# EAGLE schematic airswimmer-controller (EAGLE 6.4)
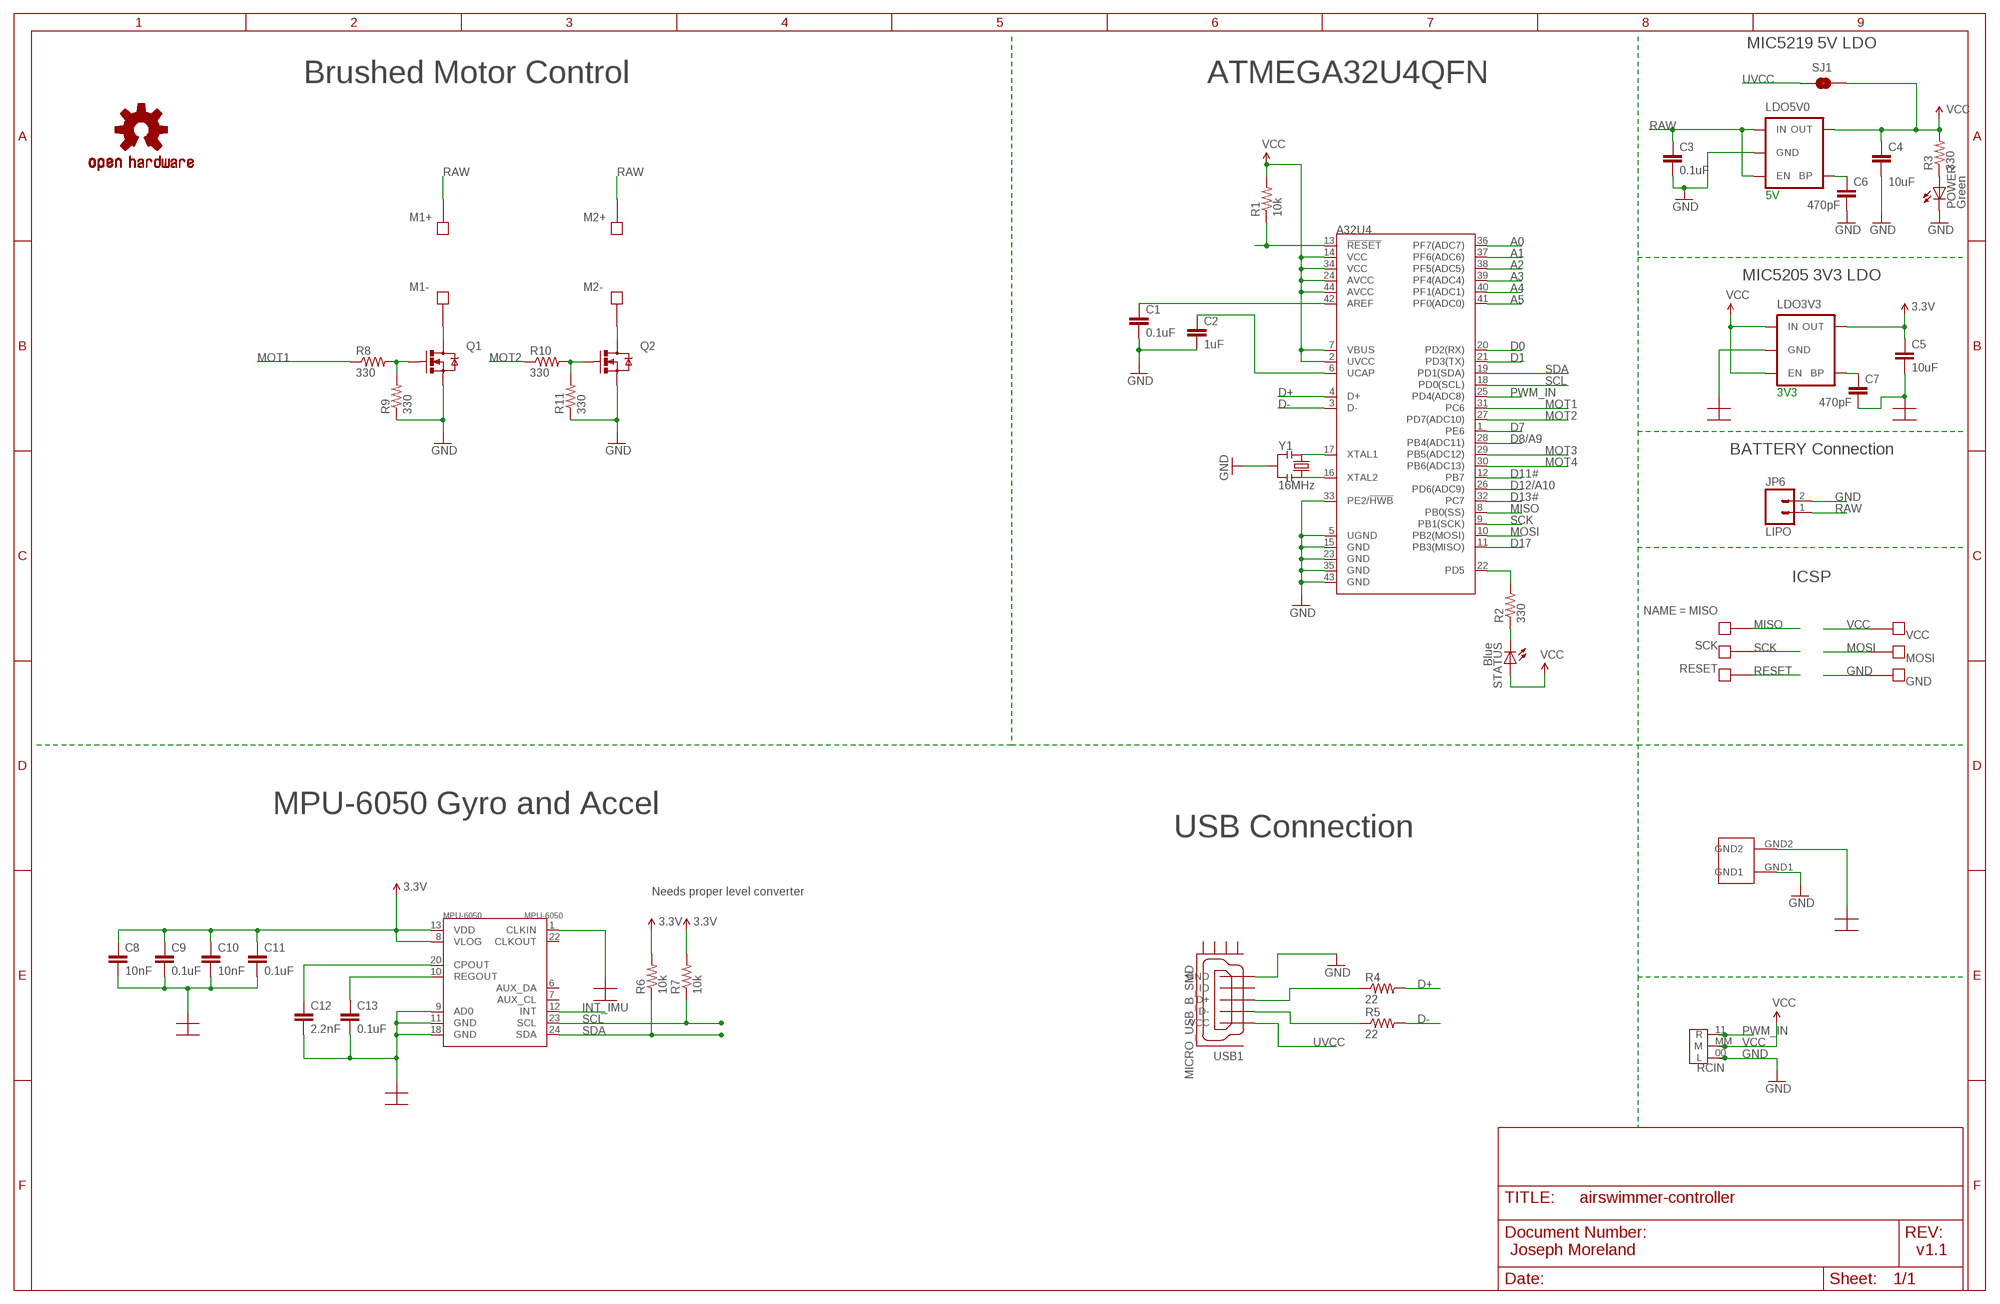
[diagram p0: schematic, sheet 1]

## Parts
A32U4  ATMEGA32U4QFN  [ATMEL_QFN-44_SMALL_PAD]
C1  0.1uF  SPARKFUN_CAP0402-CAP  [SPARKFUN_0402-CAP]
C2  1uF  SPARKFUN_CAP0402-CAP  [SPARKFUN_0402-CAP]
C3  0.1uF  SPARKFUN_CAP0402-CAP  [SPARKFUN_0402-CAP]
C4  10uF  CAP0603-CAP  [0603-CAP]
C5  10uF  CAP0603-CAP  [0603-CAP]
C6  470pF  CAP0603-CAP  [0603-CAP]
C7  470pF  CAP0603-CAP  [0603-CAP]
C8  10nF  CAP0402-CAP  [0402-CAP]
C9  0.1uF  CAP0402-CAP  [0402-CAP]
C10  10nF  CAP0402-CAP  [0402-CAP]
C11  0.1uF  CAP0402-CAP  [0402-CAP]
C12  2.2nF  CAP0402-CAP  [0402-CAP]
C13  0.1uF  CAP0402-CAP  [0402-CAP]
GND  TEST_PAD  [ICSP_PAD]
GND_SHORT  GND_SHORT  [GND_SHORT]
JP6  LIPO  M02LOCK  [1X02_LOCK]
LDO3V3  V_REG_MIC52193.3V  [SOT23-5]
LDO5V0  MIC5219  V_REG_MIC52195V  [SOT23-5]
LOGO1  OSHW-LOGOM  [OSHW-LOGO-M]
M1+  SOLDER_PAD.05X.05  [SOLDER_PAD_.05X.05]
M1-  SOLDER_PAD.05X.05  [SOLDER_PAD_.05X.05]
M2+  SOLDER_PAD.05X.05  [SOLDER_PAD_.05X.05]
M2-  SOLDER_PAD.05X.05  [SOLDER_PAD_.05X.05]
MISO  TEST_PAD  [ICSP_PAD]
MOSI  TEST_PAD  [ICSP_PAD]
MPU-6050  MPU-6050  IMU3000  [QFN-24]
POWER  Green  LED0603  [LED-0603]
Q1  MOSFET-NCHANNELBSS123LT1G  [SOT23]
Q2  MOSFET-NCHANNELBSS123LT1G  [SOT23]
R1  10k  RESISTOR0402-RES  [0402-RES]
R2  330  RESISTOR0402-RES  [0402-RES]
R3  330  RESISTOR0402-RES  [0402-RES]
R4  22  RESISTOR0402-RES  [0402-RES]
R5  22  RESISTOR0402-RES  [0402-RES]
R6  10k  RESISTOR0402-RES  [0402-RES]
R7  10k  RESISTOR0402-RES  [0402-RES]
R8  330  RESISTOR0402-RES  [0402-RES]
R9  330  RESISTOR0402-RES  [0402-RES]
R10  330  RESISTOR0402-RES  [0402-RES]
R11  330  RESISTOR0402-RES  [0402-RES]
RCIN  PAD-JUMPER-3P40*40  [3P-SMD-4.1X1.5]
RESET  TEST_PAD  [ICSP_PAD]
SCK  TEST_PAD  [ICSP_PAD]
SJ1  P-USB  SPARKFUN_SOLDERJUMPERNC  [SPARKFUN_SJ_2S]
STATUS  Blue  LED0603  [LED-0603]
USB1  MICRO_USB_B_SMD  [MOLEX_MICRO_USB_B_BOTTOM_MOUNT]
VCC  TEST_PAD  [ICSP_PAD]
Y1  16MHz  RESONATOR16MHZ  [RESONATOR-SMD]

## Nets
3.3V: C5.1 C8.1 C9.1 C10.1 C11.1 LDO3V3.5(OUT) MPU-6050.8(VLOG) MPU-6050.13(VDD) R6.2 R7.2
A0: A32U4.36(PF7(ADC7))
A1: A32U4.37(PF6(ADC6))
A2: A32U4.38(PF5(ADC5))
A3: A32U4.39(PF4(ADC4))
A4: A32U4.40(PF1(ADC1))
A5: A32U4.41(PF0(ADC0))
AREF: A32U4.42(AREF) C1.1
D0: A32U4.20(PD2(RX))
D1: A32U4.21(PD3(TX))
D7: A32U4.1(PE6)
D8/A9: A32U4.28(PB4(ADC11))
D11#: A32U4.12(PB7)
D12/A10: A32U4.26(PD6(ADC9))
D13#: A32U4.32(PC7)
D17: A32U4.11(PB3(MISO))
D+: A32U4.4(D+) R4.2
D-: A32U4.3(D-) R5.2
DGND: C5.2 C7.2 C8.2 C9.2 C10.2 C11.2 C12.2 C13.2 GND_SHORT.GND2 LDO3V3.2(GND) MPU-6050.1(CLKIN) MPU-6050.9(AD0) MPU-6050.11(GND) MPU-6050.18(GND)
GND: A32U4.5(UGND) A32U4.15(GND) A32U4.23(GND) A32U4.33(PE2/!HWB) A32U4.35(GND) A32U4.43(GND) C1.2 C2.2 C3.2 C4.2 C6.2 GND.P$1(NET) GND_SHORT.GND1 JP6.2 LDO5V0.2(GND) POWER.C Q1.2(S) Q2.2(S) R9.1 R11.1 RCIN.00(L) USB1.5(GND) Y1.2
INT_IMU: MPU-6050.12(INT)
MISO: A32U4.8(PB0(SS)) MISO.P$1(NET)
MOSI: A32U4.10(PB2(MOSI)) MOSI.P$1(NET)
MOT1: A32U4.31(PC6) R8.1
MOT2: A32U4.27(PD7(ADC10)) R10.1
MOT3: A32U4.29(PB5(ADC12))
MOT4: A32U4.30(PB6(ADC13))
N$1: R4.1 USB1.3(D+)
N$2: C6.1 LDO5V0.4(BP)
N$3: A32U4.17(XTAL1) Y1.1
N$4: C7.1 LDO3V3.4(BP)
N$5: M1-.P$1(NET) Q1.3(D)
N$6: A32U4.16(XTAL2) Y1.3
N$8: R2.1 STATUS.C
N$9: M2-.P$1(NET) Q2.3(D)
N$10: POWER.A R3.1
N$11: R5.1 USB1.2(D-)
N$14: C13.1 MPU-6050.10(REGOUT)
N$15: C12.1 MPU-6050.20(CPOUT)
N$16: Q1.1(G) R8.2 R9.2
N$17: Q2.1(G) R10.2 R11.2
N$33: A32U4.22(PD5) R2.2
PWM_IN: A32U4.25(PD4(ADC8)) RCIN.11(R)
RAW: C3.1 JP6.1 LDO5V0.1(IN) LDO5V0.3(EN) M1+.P$1(NET) M2+.P$1(NET)
RESET: A32U4.13(!RESET) R1.1 RESET.P$1(NET)
SCK: A32U4.9(PB1(SCK)) SCK.P$1(NET)
SCL: A32U4.18(PD0(SCL)) MPU-6050.23(SCL) R7.1
SDA: A32U4.19(PD1(SDA)) MPU-6050.24(SDA) R6.1
UCAP: A32U4.6(UCAP) C2.1
UVCC: SJ1.1 USB1.1(VCC)
VCC: A32U4.2(UVCC) A32U4.7(VBUS) A32U4.14(VCC) A32U4.24(AVCC) A32U4.34(VCC) A32U4.44(AVCC) C4.1 LDO3V3.1(IN) LDO3V3.3(EN) LDO5V0.5(OUT) R1.2 R3.2 RCIN.MM(M) SJ1.2 STATUS.A VCC.P$1(NET)
Unconnected: MPU-6050.6(AUX_DA) MPU-6050.7(AUX_CL) MPU-6050.22(CLKOUT) USB1.4(ID) USB1.GND1 USB1.GND2 USB1.GND3 USB1.GND4

## Notes on the sheet
- MIC5219 5V LDO
- Brushed Motor Control
- 5V
- MIC5205 3V3 LDO
- 3V3
- BATTERY Connection
- ICSP
- MPU-6050 Gyro and Accel
- USB Connection
- Needs proper level converter
- Joseph Moreland | v1.1

## Library data of the parts
A32U4 = JCM:ATMEGA32U4: Atmel 44-pin 8-bit Microcontroller with 32KBytes of ISP Flash and USB Controller; PARTNO: ATMEGA32U4-MU
C1 C3 = LogicA:SPARKFUN_CAP: Capacitor Standard 0603 ceramic capacitor, and 0.1" leaded capacitor.; PARTNO: GMK105BJ104KV-F
C2 = LogicA:SPARKFUN_CAP: Capacitor Standard 0603 ceramic capacitor, and 0.1" leaded capacitor.; PARTNO: LMK105BJ105KV-F
C4 C5 = SparkFun-Capacitors:CAP: Capacitor Standard 0603 ceramic capacitor, and 0.1" leaded capacitor.; PARTNO: TCM1A106M8R; TYPE: Tantalum
C6 C7 = SparkFun-Capacitors:CAP: Capacitor Standard 0603 ceramic capacitor, and 0.1" leaded capacitor.; PARTNO: C0603C471K5RACTU
C8 C10 = SparkFun-Capacitors:CAP: Capacitor Standard 0603 ceramic capacitor, and 0.1" leaded capacitor.; PARTNO: C0402C103K8RACTU
C9 C11 C13 = SparkFun-Capacitors:CAP: Capacitor Standard 0603 ceramic capacitor, and 0.1" leaded capacitor.; PARTNO: GMK105BJ104KV-F
C12 = SparkFun-Capacitors:CAP: Capacitor Standard 0603 ceramic capacitor, and 0.1" leaded capacitor.; PARTNO: C0402C222K4RACTU
GND MISO MOSI RESET SCK VCC = JCM:TEST_PAD; PARTNO: DNP
GND_SHORT = JCM:GND_SHORT; PARTNO: DNP
JP6 = SparkFun-Connectors:M02: Header 2 Standard 2-pin 0.1" header. Use with straight break away headers (SKU : PRT-00116), right angle break away headers (PRT-00553), swiss pins (PRT-00743), machine pins (PRT-00117), and female headers (PRT-00115). Molex polarized connector foot print use with SKU : PRT-08233 with associated crimp pins and housings.; PARTNO: DNP
LDO3V3 = SparkFun-PowerIC:V_REG_MIC5219: V_REG MIC5219 Standard 500mA LDO voltage regulator in SOT-23 layout. Micrel part MIC5219. BP (by-pass) pin is used to lower output noise with 470pF cap, may be left open.; PARTNO: MIC5219-3.3YM5 TR; PROD_ID: VREG-09872; VALUE: MIC5219 3.3V
LDO5V0 = SparkFun-PowerIC:V_REG_MIC5219: V_REG MIC5219 Standard 500mA LDO voltage regulator in SOT-23 layout. Micrel part MIC5219. BP (by-pass) pin is used to lower output noise with 470pF cap, may be left open.; PARTNO: MIC5219-5.0YM5 TR; PROD_ID: VREG-10107; VALUE: MIC5219 5V
LOGO1 = SparkFun-Aesthetics:OSHW-LOGO: Open Source Hardware Logo This logo indicates the piece of hardware it is found on incorporates a OSHW license and/or adheres to the definition of open source hardware found here: http://freedomdefined.org/OSHW; PARTNO: DNP
M1+ M1- M2+ M2- = JCM:SOLDER_PAD; PARTNO: DNP
MPU-6050 = SparkFun-Sensors:IMU3000: 3-axis I2C programmable gyro. Can interface with an I2C accelerometer to provide 6-axis motion information.; PARTNO: *
POWER = SparkFun-LED:LED: LEDs Standard schematic elements and footprints for 5mm, 3mm, 1206, and 0603 sized LEDs. 5mm - Spark Fun Electronics SKU : COM-00529 (and others); PARTNO: LTST-C190KGKT
Q1 Q2 = SparkFun-DiscreteSemi:MOSFET-NCHANNEL: Common NMOSFET Parts MFG P/N Store ID Prod ID FDD8780 TRANS-09984 SI7820DN TRANS-11055 FDS6630A IC-08089 2N7002PW TRANS-11151 FQP30N06L COM-10213 TRANS-10060 BSS123LT1G TRANS-08345 BSS138 TRANS-00830 BS170 2N7000; PARTNO: DMG6968U-7; PROD_ID: TRANS-08345
R1 = SparkFun-Resistors:RESISTOR: Resistor Basic schematic elements and footprints for 0603, 1206, and PTH resistors.; PARTNO: CRCW040210K0FKED
R2 R3 = SparkFun-Resistors:RESISTOR: Resistor Basic schematic elements and footprints for 0603, 1206, and PTH resistors.; PARTNO: CRCW0402330RJNED
R4 R5 = SparkFun-Resistors:RESISTOR: Resistor Basic schematic elements and footprints for 0603, 1206, and PTH resistors.; PARTNO: CRCW040222R0JNED
R6 R7 = SparkFun-Passives:RESISTOR: Resistor Basic schematic elements and footprints for 0603, 1206, and PTH resistors.; PARTNO: CRCW040210K0FKED
R8-R11 = SparkFun-Passives:RESISTOR: Resistor Basic schematic elements and footprints for 0603, 1206, and PTH resistors.; PARTNO: CRCW0402330RJNED
RCIN = discretejcm:PAD-JUMPER-3P; PARTNO: DNP
SJ1 = LogicA:SPARKFUN_SOLDERJUMPER: Solder Jumper Standard SMD solder jumper. Used to automate production. Two varients : Normally Open and Normally Closed are the same, but have different paste layers. NC will have a large amount of paste and should jumper during reflow.; PARTNO: DNP
STATUS = SparkFun-LED:LED: LEDs Standard schematic elements and footprints for 5mm, 3mm, 1206, and 0603 sized LEDs. 5mm - Spark Fun Electronics SKU : COM-00529 (and others); PARTNO: LTST-C191TBKT
USB1 = JCM:MICRO_USB_B_SMD: Molex Micro USB B Receptacle, bottom mount Micro-USB technology was developed by the USB Implementers Forum, Inc. (USB-IF), an independent nonprofit group that advances USB technology. Molex's Micro-USB connectors offer advantages of smaller size and increased durability compared with the Mini-USB. Micro-USB connectors allow manufacturers to push the limits of thinner and lighter mobile devices with sleeker designs and greater portability.; DATASHEET: http://www.molex.com/webdocs/datasheets/pdf/en-us/0473460001_IO_CONNECTORS.pdf; LINK: http://www.molex.com/molex/products/family?key=micro_usb&channel=products&chanName=family&pageTitle=Introduction; MFGPN: 47346-0001; PARTNO: 473460001
Y1 = SparkFun-FreqCtrl:RESONATOR: Resonator Small SMD resonator. Used, eg, on the Arduino Pro/ Pro Mini boards. 8MHz- XTAL-08895 16MHz- XTAL-08900; PARTNO: CSTCE16M0V53-R0; PROD_ID: XTAL-08900